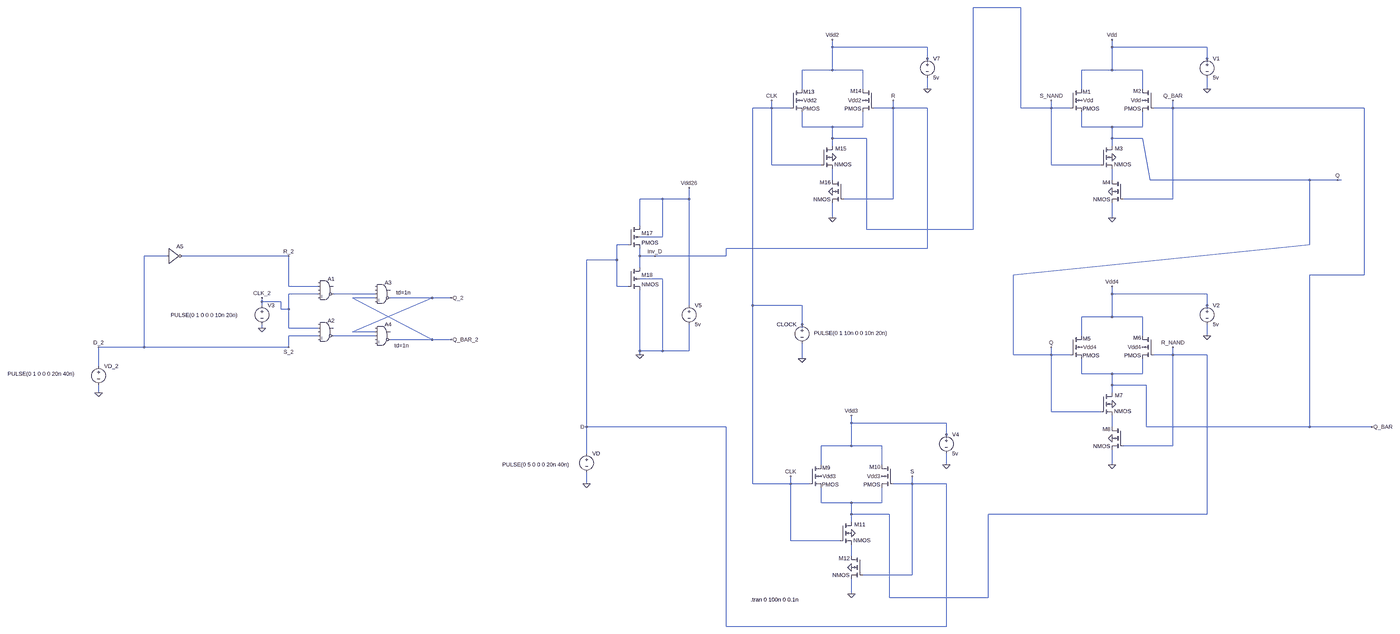
[diagram p0: schematic Latch-D.asc, whole sheet]
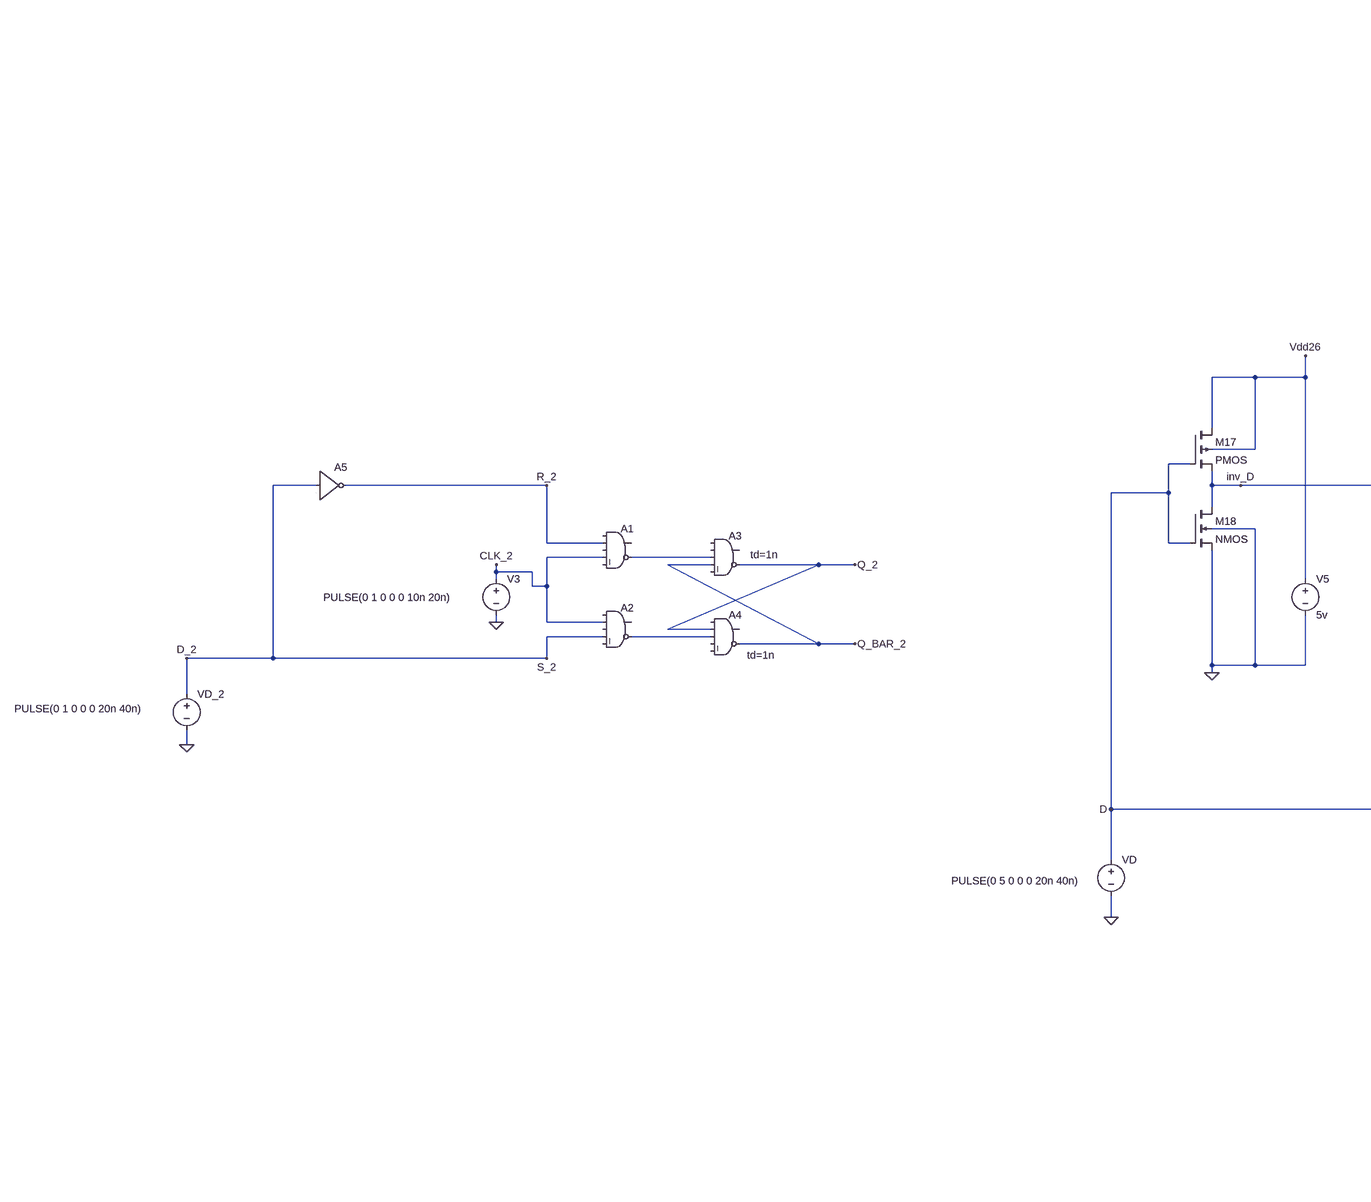
[diagram p1: schematic Latch-D.asc, part, row 1 of 1, column 1 of 2]
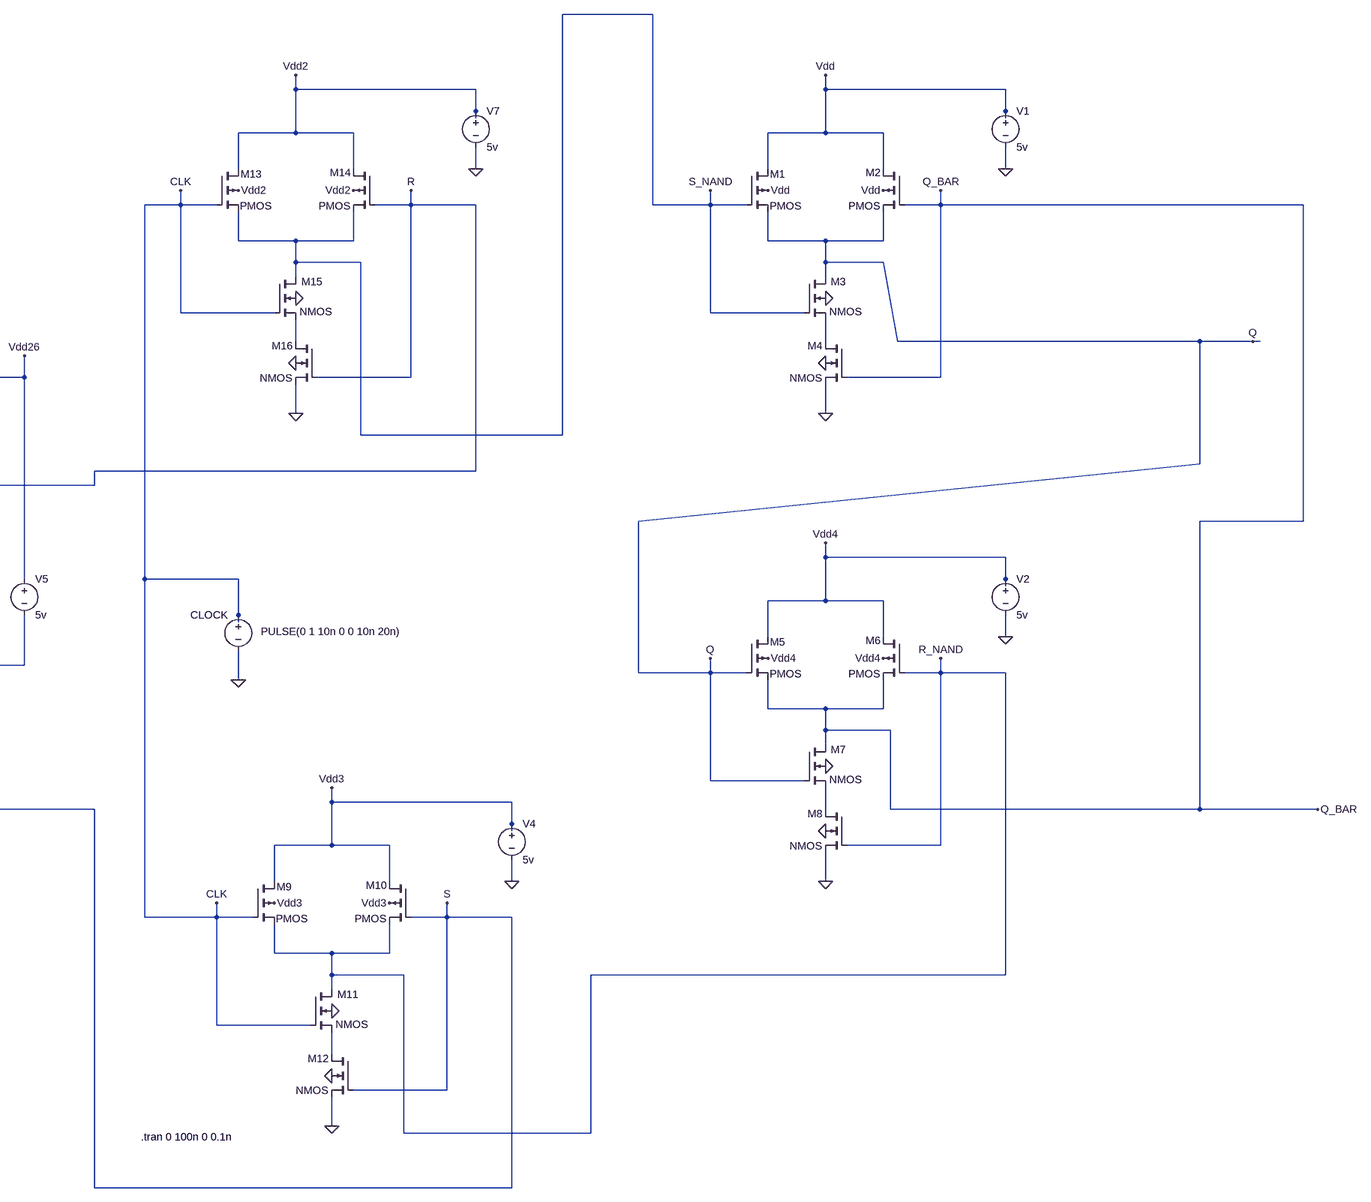
[diagram p2: schematic Latch-D.asc, part, row 1 of 1, column 2 of 2]
Latch-D.asc, the LTspice schematic file:
Version 4
SHEET 1 4144 1592
WIRE -320 -1136 -1168 -1136
WIRE -1760 -864 -1760 -896
WIRE -1360 -864 -1760 -864
WIRE 64 -864 64 -896
WIRE 464 -864 64 -864
WIRE -1360 -816 -1360 -864
WIRE 464 -816 464 -864
WIRE -1360 -800 -1360 -816
WIRE 464 -800 464 -816
WIRE -1760 -768 -1760 -864
WIRE -1760 -768 -1888 -768
WIRE -1632 -768 -1760 -768
WIRE 64 -768 64 -864
WIRE 64 -768 -64 -768
WIRE 192 -768 64 -768
WIRE -1888 -688 -1888 -768
WIRE -1632 -688 -1632 -768
WIRE -1360 -688 -1360 -736
WIRE -64 -688 -64 -768
WIRE 192 -688 192 -768
WIRE 464 -688 464 -736
WIRE -2016 -608 -2016 -640
WIRE -2016 -608 -2096 -608
WIRE -1936 -608 -2016 -608
WIRE -1504 -608 -1504 -640
WIRE -1504 -608 -1584 -608
WIRE -1360 -608 -1504 -608
WIRE -320 -608 -320 -1136
WIRE -192 -608 -192 -640
WIRE -192 -608 -320 -608
WIRE -112 -608 -192 -608
WIRE 320 -608 320 -640
WIRE 320 -608 240 -608
WIRE 1184 -608 320 -608
WIRE -1888 -528 -1888 -592
WIRE -1760 -528 -1888 -528
WIRE -1632 -528 -1632 -592
WIRE -1632 -528 -1760 -528
WIRE -64 -528 -64 -592
WIRE 64 -528 -64 -528
WIRE 192 -528 192 -592
WIRE 192 -528 64 -528
WIRE -1760 -480 -1760 -528
WIRE -1616 -480 -1760 -480
WIRE 64 -480 64 -528
WIRE 192 -480 64 -480
WIRE -1760 -448 -1760 -480
WIRE 64 -448 64 -480
WIRE -2016 -368 -2016 -608
WIRE -1808 -368 -2016 -368
WIRE -192 -368 -192 -608
WIRE 16 -368 -192 -368
WIRE -1760 -304 -1760 -352
WIRE 64 -304 64 -352
WIRE 224 -304 192 -480
WIRE 896 -304 224 -304
WIRE 1072 -304 896 -304
WIRE 1088 -304 1072 -304
WIRE -2752 -224 -2848 -224
WIRE -2640 -224 -2640 -272
WIRE -2640 -224 -2752 -224
WIRE -1504 -224 -1504 -608
WIRE -1504 -224 -1712 -224
WIRE 320 -224 320 -608
WIRE 320 -224 112 -224
WIRE -1760 -144 -1760 -208
WIRE 64 -144 64 -208
WIRE -2848 -112 -2848 -224
WIRE -1616 -96 -1616 -480
WIRE -1168 -96 -1168 -1136
WIRE -1168 -96 -1616 -96
WIRE -2752 -64 -2752 -224
WIRE -2752 -64 -2848 -64
WIRE -2896 -32 -2944 -32
WIRE 896 -32 896 -304
WIRE -1360 -16 -1360 -608
WIRE -1360 -16 -2416 -16
WIRE -5120 16 -5216 16
WIRE -4608 16 -5056 16
WIRE -2848 16 -2848 -16
WIRE -2784 16 -2848 16
WIRE -2416 16 -2416 -16
WIRE -2416 16 -2784 16
WIRE -2944 32 -2944 -32
WIRE -2944 32 -3072 32
WIRE -2848 64 -2848 16
WIRE -352 96 896 -32
WIRE 1184 96 1184 -608
WIRE 1184 96 896 96
WIRE -2752 112 -2848 112
WIRE -4608 144 -4608 16
WIRE -4480 144 -4608 144
WIRE -2944 144 -2944 32
WIRE -2896 144 -2944 144
WIRE -4480 176 -4608 176
WIRE -4240 176 -4416 176
WIRE 64 176 64 144
WIRE 464 176 64 176
WIRE -4240 192 -4336 192
WIRE -4000 192 -4176 192
WIRE -3920 192 -4000 192
WIRE -4720 208 -4720 192
WIRE -4640 208 -4720 208
WIRE -4720 224 -4720 208
WIRE -2640 224 -2640 -224
WIRE -2096 224 -2096 -608
WIRE -1888 224 -2096 224
WIRE 464 224 464 176
WIRE -4640 240 -4640 208
WIRE -4608 240 -4608 176
WIRE -4608 240 -4640 240
WIRE 464 240 464 224
WIRE 64 272 64 176
WIRE 64 272 -64 272
WIRE 192 272 64 272
WIRE -1888 304 -1888 224
WIRE -4720 320 -4720 304
WIRE -4608 320 -4608 240
WIRE -4480 320 -4608 320
WIRE -1888 320 -1888 304
WIRE -4336 336 -4000 192
WIRE -4240 336 -4336 336
WIRE -4480 352 -4608 352
WIRE -4240 352 -4416 352
WIRE -64 352 -64 272
WIRE 192 352 192 272
WIRE 464 352 464 304
WIRE -4000 368 -4336 192
WIRE -4000 368 -4176 368
WIRE -3920 368 -4000 368
WIRE -5216 400 -5216 16
WIRE -5216 400 -5408 400
WIRE -4608 400 -4608 352
WIRE -4608 400 -5216 400
WIRE -2848 416 -2848 160
WIRE -2752 416 -2752 112
WIRE -2752 416 -2848 416
WIRE -2640 416 -2640 304
WIRE -2640 416 -2752 416
WIRE -2848 432 -2848 416
WIRE -352 432 -352 96
WIRE -192 432 -192 400
WIRE -192 432 -352 432
WIRE -112 432 -192 432
WIRE 320 432 320 400
WIRE 320 432 240 432
WIRE 464 432 320 432
WIRE -1888 448 -1888 384
WIRE -5408 480 -5408 400
WIRE -64 512 -64 448
WIRE 64 512 -64 512
WIRE 192 512 192 448
WIRE 192 512 64 512
WIRE 64 560 64 512
WIRE 208 560 64 560
WIRE -5408 592 -5408 560
WIRE 64 592 64 560
WIRE -192 672 -192 432
WIRE 16 672 -192 672
WIRE -1680 720 -1680 688
WIRE -1280 720 -1680 720
WIRE -3072 736 -3072 32
WIRE -2416 736 -3072 736
WIRE 64 736 64 688
WIRE 208 736 208 560
WIRE 896 736 896 96
WIRE 896 736 208 736
WIRE 1216 736 896 736
WIRE -1280 768 -1280 720
WIRE -1280 784 -1280 768
WIRE -1680 816 -1680 720
WIRE -1680 816 -1808 816
WIRE -1552 816 -1680 816
WIRE 320 816 320 432
WIRE 320 816 112 816
WIRE -3072 848 -3072 736
WIRE -1808 896 -1808 816
WIRE -1552 896 -1552 816
WIRE -1280 896 -1280 848
WIRE 64 896 64 832
WIRE -3072 976 -3072 928
WIRE -2096 976 -2096 224
WIRE -1936 976 -1936 944
WIRE -1936 976 -2096 976
WIRE -1856 976 -1936 976
WIRE -1424 976 -1424 944
WIRE -1424 976 -1504 976
WIRE -1280 976 -1424 976
WIRE -1808 1056 -1808 992
WIRE -1680 1056 -1808 1056
WIRE -1552 1056 -1552 992
WIRE -1552 1056 -1680 1056
WIRE -1680 1104 -1680 1056
WIRE -1520 1104 -1680 1104
WIRE 464 1104 464 432
WIRE 464 1104 -1104 1104
WIRE -1680 1136 -1680 1104
WIRE -1936 1216 -1936 976
WIRE -1728 1216 -1936 1216
WIRE -1680 1280 -1680 1232
WIRE -1424 1360 -1424 976
WIRE -1424 1360 -1632 1360
WIRE -1680 1440 -1680 1376
WIRE -1520 1456 -1520 1104
WIRE -1104 1456 -1104 1104
WIRE -1104 1456 -1520 1456
WIRE -2416 1584 -2416 736
WIRE -1280 1584 -1280 976
WIRE -1280 1584 -2416 1584
FLAG 64 -144 0
FLAG 64 -896 Vdd
FLAG -64 -640 Vdd
FLAG 192 -640 Vdd
FLAG -192 -640 S_NAND
FLAG 320 -640 Q_BAR
FLAG 464 -688 0
FLAG 64 -400 0
FLAG 64 -256 0
FLAG 64 896 0
FLAG 64 144 Vdd4
FLAG -64 400 Vdd4
FLAG 192 400 Vdd4
FLAG -192 400 Q
FLAG 320 400 R_NAND
FLAG 464 352 0
FLAG 64 640 0
FLAG 64 784 0
FLAG 1072 -304 Q
FLAG 1216 736 Q_BAR
FLAG -1680 1440 0
FLAG -1680 688 Vdd3
FLAG -1808 944 Vdd3
FLAG -1552 944 Vdd3
FLAG -1936 944 CLK
FLAG -1424 944 S
FLAG -1280 896 0
FLAG -1680 1184 0
FLAG -1680 1328 0
FLAG -1760 -144 0
FLAG -3072 976 0
FLAG -1888 448 0
FLAG -1760 -896 Vdd2
FLAG -1888 -640 Vdd2
FLAG -1632 -640 Vdd2
FLAG -2016 -640 CLK
FLAG -1504 -640 R
FLAG -1360 -688 0
FLAG -1760 -400 0
FLAG -1760 -256 0
FLAG -3920 192 Q_2
FLAG -3920 368 Q_BAR_2
FLAG -4720 320 0
FLAG -4720 192 CLK_2
FLAG -5408 592 0
FLAG -4608 16 R_2
FLAG -4608 400 S_2
FLAG -5408 400 D_2
FLAG -2848 432 0
FLAG -2640 -272 Vdd26
FLAG -2784 16 inv_D
FLAG -3072 736 D
SYMBOL pmos4 -112 -688 R0
WINDOW 0 53 12 Left 2
WINDOW 3 52 83 Left 2
SYMATTR InstName M1
SYMATTR Value2 l=0.6u w=6u
SYMBOL pmos4 240 -688 M0
WINDOW 0 53 9 Left 2
WINDOW 3 55 83 Left 2
SYMATTR InstName M2
SYMATTR Value2 l=0.6u w=6u
SYMBOL nmos4 16 -448 R0
WINDOW 0 60 11 Left 2
WINDOW 3 56 78 Left 2
SYMATTR InstName M3
SYMATTR Value2 l=0.6u w=3u
SYMBOL nmos4 112 -304 M0
WINDOW 0 54 10 Left 2
WINDOW 3 56 81 Left 2
SYMATTR InstName M4
SYMATTR Value2 l=0.6u w=3u
SYMBOL voltage 464 -832 R0
WINDOW 123 0 0 Left 0
WINDOW 39 0 0 Left 0
SYMATTR InstName V1
SYMATTR Value 5v
SYMBOL pmos4 -112 352 R0
WINDOW 0 53 12 Left 2
WINDOW 3 52 83 Left 2
SYMATTR InstName M5
SYMATTR Value2 l=0.6u w=6u
SYMBOL pmos4 240 352 M0
WINDOW 0 53 9 Left 2
WINDOW 3 55 83 Left 2
SYMATTR InstName M6
SYMATTR Value2 l=0.6u w=6u
SYMBOL nmos4 16 592 R0
WINDOW 0 60 11 Left 2
WINDOW 3 56 78 Left 2
SYMATTR InstName M7
SYMATTR Value2 l=0.6u w=3u
SYMBOL nmos4 112 736 M0
WINDOW 0 54 10 Left 2
WINDOW 3 56 81 Left 2
SYMATTR InstName M8
SYMATTR Value2 l=0.6u w=3u
SYMBOL voltage 464 208 R0
WINDOW 123 0 0 Left 0
WINDOW 39 0 0 Left 0
SYMATTR InstName V2
SYMATTR Value 5v
SYMBOL pmos4 -1856 896 R0
WINDOW 0 53 12 Left 2
WINDOW 3 52 83 Left 2
SYMATTR InstName M9
SYMATTR Value2 l=0.6u w=6u
SYMBOL pmos4 -1504 896 M0
WINDOW 0 53 9 Left 2
WINDOW 3 55 83 Left 2
SYMATTR InstName M10
SYMATTR Value2 l=0.6u w=6u
SYMBOL nmos4 -1728 1136 R0
WINDOW 0 60 11 Left 2
WINDOW 3 56 78 Left 2
SYMATTR InstName M11
SYMATTR Value2 l=0.6u w=3u
SYMBOL nmos4 -1632 1280 M0
WINDOW 0 54 10 Left 2
WINDOW 3 56 81 Left 2
SYMATTR InstName M12
SYMATTR Value2 l=0.6u w=3u
SYMBOL voltage -1280 752 R0
WINDOW 123 0 0 Left 0
WINDOW 39 0 0 Left 0
SYMATTR InstName V4
SYMATTR Value 5v
SYMBOL voltage -1888 288 M0
WINDOW 3 -361 53 Left 2
WINDOW 123 0 0 Left 0
WINDOW 39 0 0 Left 0
SYMATTR Value PULSE(0 1 10n 0 0 10n 20n)
SYMATTR InstName CLOCK
SYMBOL pmos4 -1936 -688 R0
WINDOW 0 53 12 Left 2
WINDOW 3 52 83 Left 2
SYMATTR InstName M13
SYMATTR Value2 l=0.6u w=6u
SYMBOL pmos4 -1584 -688 M0
WINDOW 0 53 9 Left 2
WINDOW 3 55 83 Left 2
SYMATTR InstName M14
SYMATTR Value2 l=0.6u w=6u
SYMBOL nmos4 -1808 -448 R0
WINDOW 0 60 11 Left 2
WINDOW 3 56 78 Left 2
SYMATTR InstName M15
SYMATTR Value2 l=0.6u w=3u
SYMBOL nmos4 -1712 -304 M0
WINDOW 0 54 10 Left 2
WINDOW 3 56 81 Left 2
SYMATTR InstName M16
SYMATTR Value2 l=0.6u w=3u
SYMBOL voltage -1360 -832 R0
WINDOW 123 0 0 Left 0
WINDOW 39 0 0 Left 0
SYMATTR InstName V7
SYMATTR Value 5v
SYMBOL voltage -3072 832 R0
WINDOW 3 -71 63 Right 2
WINDOW 123 0 0 Left 0
WINDOW 39 0 0 Left 0
SYMATTR Value PULSE(0 5 0 0 0 20n 40n)
SYMATTR InstName VD
SYMBOL voltage -4720 208 R0
WINDOW 3 -384 57 Left 2
WINDOW 123 0 0 Left 0
WINDOW 39 0 0 Left 0
SYMATTR Value PULSE(0 1 0 0 0 10n 20n)
SYMATTR InstName V3
SYMBOL Digital\\and -4448 96 R0
SYMATTR InstName A1
SYMBOL Digital\\and -4448 272 R0
SYMATTR InstName A2
SYMBOL Digital\\and -4208 112 R0
WINDOW 3 56 58 Left 2
SYMATTR Value td=1n
SYMATTR InstName A3
SYMBOL Digital\\and -4208 288 R0
WINDOW 3 49 105 Left 2
SYMATTR Value td=1n
SYMATTR InstName A4
SYMBOL voltage -5408 464 R0
WINDOW 3 -383 48 Left 2
WINDOW 123 0 0 Left 0
WINDOW 39 0 0 Left 0
SYMATTR Value PULSE(0 1 0 0 0 20n 40n)
SYMATTR InstName VD_2
SYMBOL Digital\\inv -5120 -48 R0
SYMATTR InstName A5
SYMBOL pmos4 -2896 -112 R0
SYMATTR InstName M17
SYMATTR Value2 l=0.6u w=6u
SYMBOL nmos4 -2896 64 R0
SYMATTR InstName M18
SYMATTR Value2 l=0.6u w=3u
SYMBOL voltage -2640 208 R0
WINDOW 123 0 0 Left 0
WINDOW 39 0 0 Left 0
SYMATTR InstName V5
SYMATTR Value 5v
TEXT -2104 1464 Left 2 !.tran 0 100n 0 0.1n

The netlist it stands for:
* Latch-D.asc
M1 Vdd S_NAND Q Vdd PMOS l=0.6u w=6u
M2 Vdd Q_BAR Q Vdd PMOS l=0.6u w=6u
M3 Q S_NAND N002 0 NMOS l=0.6u w=3u
M4 N002 Q_BAR 0 0 NMOS l=0.6u w=3u
V1 Vdd 0 5v
M5 Vdd4 Q Q_BAR Vdd4 PMOS l=0.6u w=6u
M6 Vdd4 R_NAND Q_BAR Vdd4 PMOS l=0.6u w=6u
M7 Q_BAR Q N005 0 NMOS l=0.6u w=3u
M8 N005 R_NAND 0 0 NMOS l=0.6u w=3u
V2 Vdd4 0 5v
M9 Vdd3 CLK R_NAND Vdd3 PMOS l=0.6u w=6u
M10 Vdd3 D R_NAND Vdd3 PMOS l=0.6u w=6u
M11 R_NAND CLK N006 0 NMOS l=0.6u w=3u
M12 N006 D 0 0 NMOS l=0.6u w=3u
V4 Vdd3 0 5v
V§CLOCK CLK 0 PULSE(0 1 10n 0 0 10n 20n)
M13 Vdd2 CLK S_NAND Vdd2 PMOS l=0.6u w=6u
M14 Vdd2 inv_D S_NAND Vdd2 PMOS l=0.6u w=6u
M15 S_NAND CLK N001 0 NMOS l=0.6u w=3u
M16 N001 inv_D 0 0 NMOS l=0.6u w=3u
V7 Vdd2 0 5v
VD D 0 PULSE(0 5 0 0 0 20n 40n)
V3 CLK_2 0 PULSE(0 1 0 0 0 10n 20n)
A1 0 R_2 0 CLK_2 0 N003 0 0 AND
A2 0 CLK_2 0 D_2 0 N004 0 0 AND
A3 0 0 N003 Q_BAR_2 0 Q_2 0 0 AND td=1n
A4 0 Q_2 N004 0 0 Q_BAR_2 0 0 AND td=1n
VD_2 D_2 0 PULSE(0 1 0 0 0 20n 40n)
A5 D_2 0 0 0 0 R_2 0 0 BUF
M17 Vdd26 D inv_D Vdd26 PMOS l=0.6u w=6u
M18 inv_D D 0 0 NMOS l=0.6u w=3u
V5 Vdd26 0 5v
.model NMOS NMOS
.model PMOS PMOS
.lib standard.mos
.tran 0 100n 0 0.1n
.backanno
.end